# EAGLE design aircitizen-m5stack-v2 (EAGLE 9.4.2)

## Sheet 1 of 2
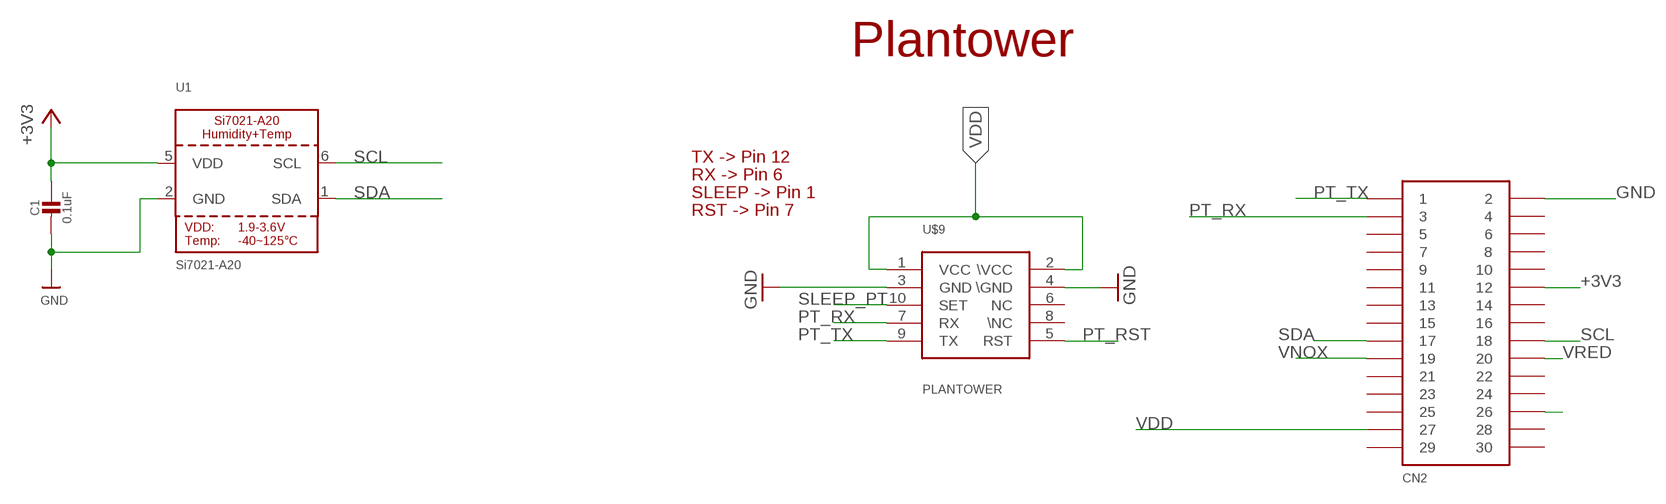
[diagram p0: schematic, sheet 1]

### Parts
C1  0.1uF  CAP_CERAMIC_1206  [_1206]
CN2  CON_PINHD-2X15  [2X15SMD]
U1  Si7021-A20  SI7021-A20  [DFN6_3X3_SI]
U$9  PLANTOWER  [CONN]

### Nets
+3V3: C1.1 CN2.P$12 U1.5(VDD)
GND: C1.2 CN2.P$2 U1.2(GND) U$9.3(GND) U$9.4(\GND) ; also sheet 2
PRE26: CN2.P$26 ; also sheet 2
PT_RST: U$9.5(RST)
PT_RX: CN2.P$3 U$9.7(RX)
PT_TX: CN2.P$1 U$9.9(TX)
SCL: CN2.P$18 U1.6(SCL)
SDA: CN2.P$17 U1.1(SDA)
SLEEP_PT: U$9.10(SET)
VDD: CN2.P$27 U$9.1(VCC) U$9.2(\VCC) ; also sheet 2
VNOX: CN2.P$19 ; also sheet 2
VRED: CN2.P$20 ; also sheet 2
Unconnected: CN2.P$4 CN2.P$5 CN2.P$6 CN2.P$7 CN2.P$8 CN2.P$9 CN2.P$10 CN2.P$11 CN2.P$13 CN2.P$14 CN2.P$15 CN2.P$16 CN2.P$21 CN2.P$22 CN2.P$23 CN2.P$24 CN2.P$25 CN2.P$28 CN2.P$29 CN2.P$30 U$9.6(NC) U$9.8(\NC)

### Notes on the sheet
- Plantower
- TX -> Pin 12
- RX -> Pin 6
- SLEEP -> Pin 1
- RST -> Pin 7

## Sheet 2 of 2
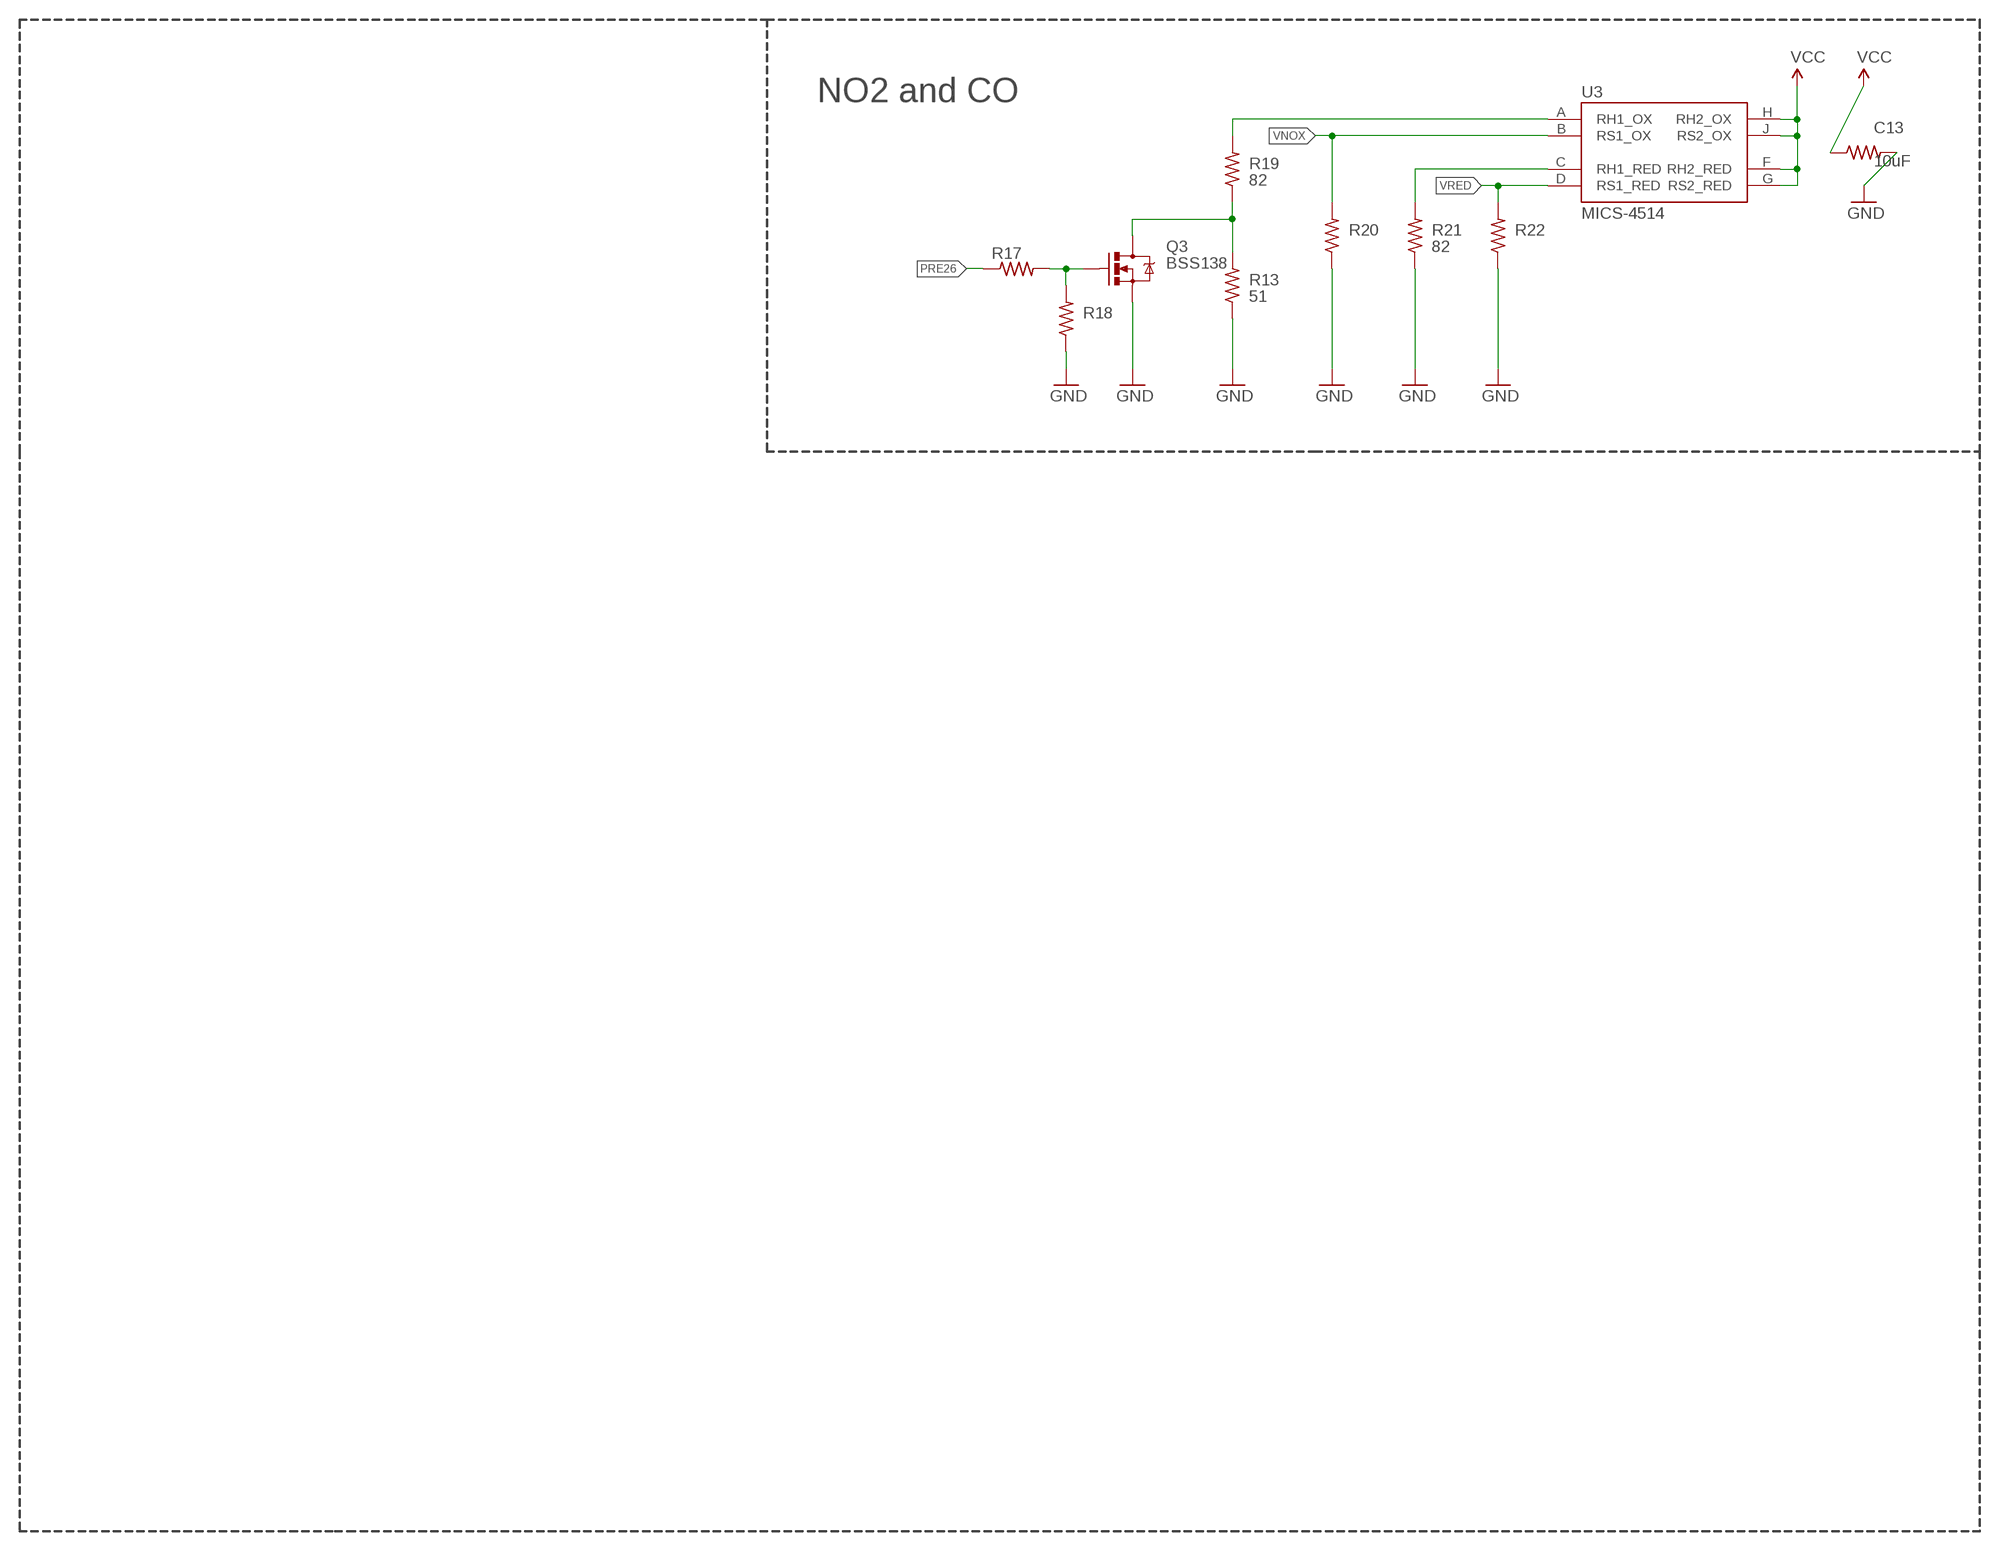
[diagram p1: schematic, sheet 2]

### Parts
C13  10uF  RES-US1206FAB  [R1206FAB]
Q3  MOSFET-NCHANNELBSS138  [SOT23-3]
R13  51  RES-US1206FAB  [R1206FAB]
R17  100  RES-US1206FAB  [R1206FAB]
R18  100K  RES-US1206FAB  [R1206FAB]
R19  82  RES-US1206FAB  [R1206FAB]
R20  22K  RES-US1206FAB  [R1206FAB]
R21  82  RES-US1206FAB  [R1206FAB]
R22  47K  RES-US1206FAB  [R1206FAB]
U3  MICS-4514  [MICS_10-SMD]

### Nets
GND: C13.2 Q3.2(S) R13.1 R18.1 R20.1 R21.1 R22.1 ; also sheet 1
N$7: Q3.3(D) R13.2 R19.1
N$13: Q3.1(G) R17.2 R18.2
N$15: R19.2 U3.A(RH1_OX)
N$16: R21.2 U3.C(RH1_RED)
PRE26: R17.1 ; also sheet 1
VDD: C13.1 U3.F(RH2_RED) U3.G(RS2_RED) U3.H(RH2_OX) U3.J(RS2_OX) ; supply symbol labelled VCC ; also sheet 1
VNOX: R20.2 U3.B(RS1_OX) ; also sheet 1
VRED: R22.2 U3.D(RS1_RED) ; also sheet 1

### Notes on the sheet
- NO2 and CO

## Library data of the parts
C1 = microbuilder:CAP_CERAMIC: Ceramic Capacitors For new designs, use the packages preceded by an '_' character since they are more reliable: The following footprints should be used on most boards: _0402 - Standard footprint for regular board layouts _0603 - Standard footprint for regular board layouts _0805 - Standard footprint for regular board layouts _1206 - Standard footprint for regular board layouts For extremely tight-pitch boards where space is at a premium, the following 'micro-pitch' footprints can be used (smaller pads, no silkscreen outline, etc.): _0402MP - Micro-pitch footprint for very dense/compact boards _0603MP - Micro-pitch footprint for very dense/compact boards _0805MP - Micro-pitch footprint for very dense/compact boards _1206MP - Micro-pitch footprint for very dense/compact boards
C13 = fab:RES-US: Resistor (US Symbol) Variants with postfix FAB are widened to allow the routing of internal traces; PROD_ID: CAP-11330
CN2 = akita:CON_PINHD-2X15
Q3 = SparkFun-DiscreteSemi:MOSFET-NCHANNEL: Common NMOSFET Parts MFG P/N Store ID Prod ID FDD8780 TRANS-09984 SI7820DN TRANS-11055 FDS6630A IC-08089 2N7002PW TRANS-11151 FQP30N06L COM-10213 TRANS-10060 BSS123LT1G TRANS-08345 BSS138 TRANS-00830 BS170 2N7000; PROD_ID: TRANS-00830; P_NAME: BSS138
R13 = fab:RES-US: Resistor (US Symbol) Variants with postfix FAB are widened to allow the routing of internal traces; PROD_ID: RES-12314
R17 R18 R20 R22 = fab:RES-US: Resistor (US Symbol) Variants with postfix FAB are widened to allow the routing of internal traces
R19 R21 = fab:RES-US: Resistor (US Symbol) Variants with postfix FAB are widened to allow the routing of internal traces; DK_ID: 541-82.0CCT-ND
U1 = microbuilder:SI7021-A20: Si7021-A20 - I2C Humidity and Temperature Sensor VDD: 1.9-3.6V Operating Temperature: -40~125°C +/-3% RH (max) 0..80% RH Humidity Sensor +/-0.4°C (max-, -10~85°C Temperature Sensor 150uA Active, 60nA Standby
U3 = SparkFun-Sensors:MICS-4514: Metal oxide MEMS carbon monoxide (CO) and NOx sensor in an SMD package.; PROD_ID: COMP-12310
U$9 = Airbeam:PLANTOWER

## Board
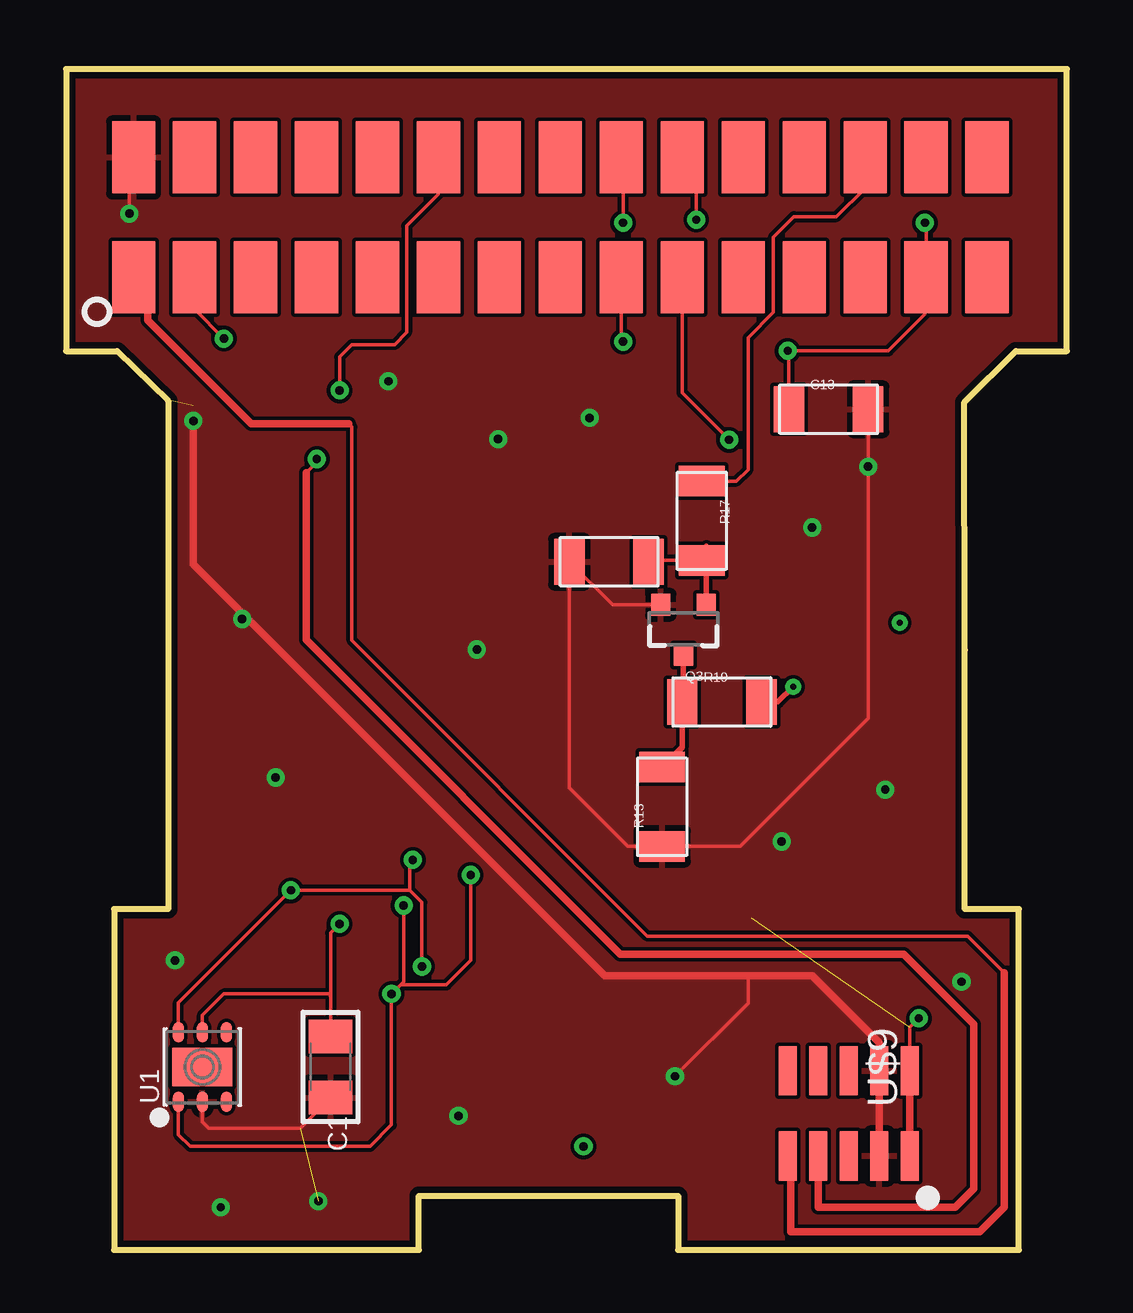
[diagram p2: board, top side]
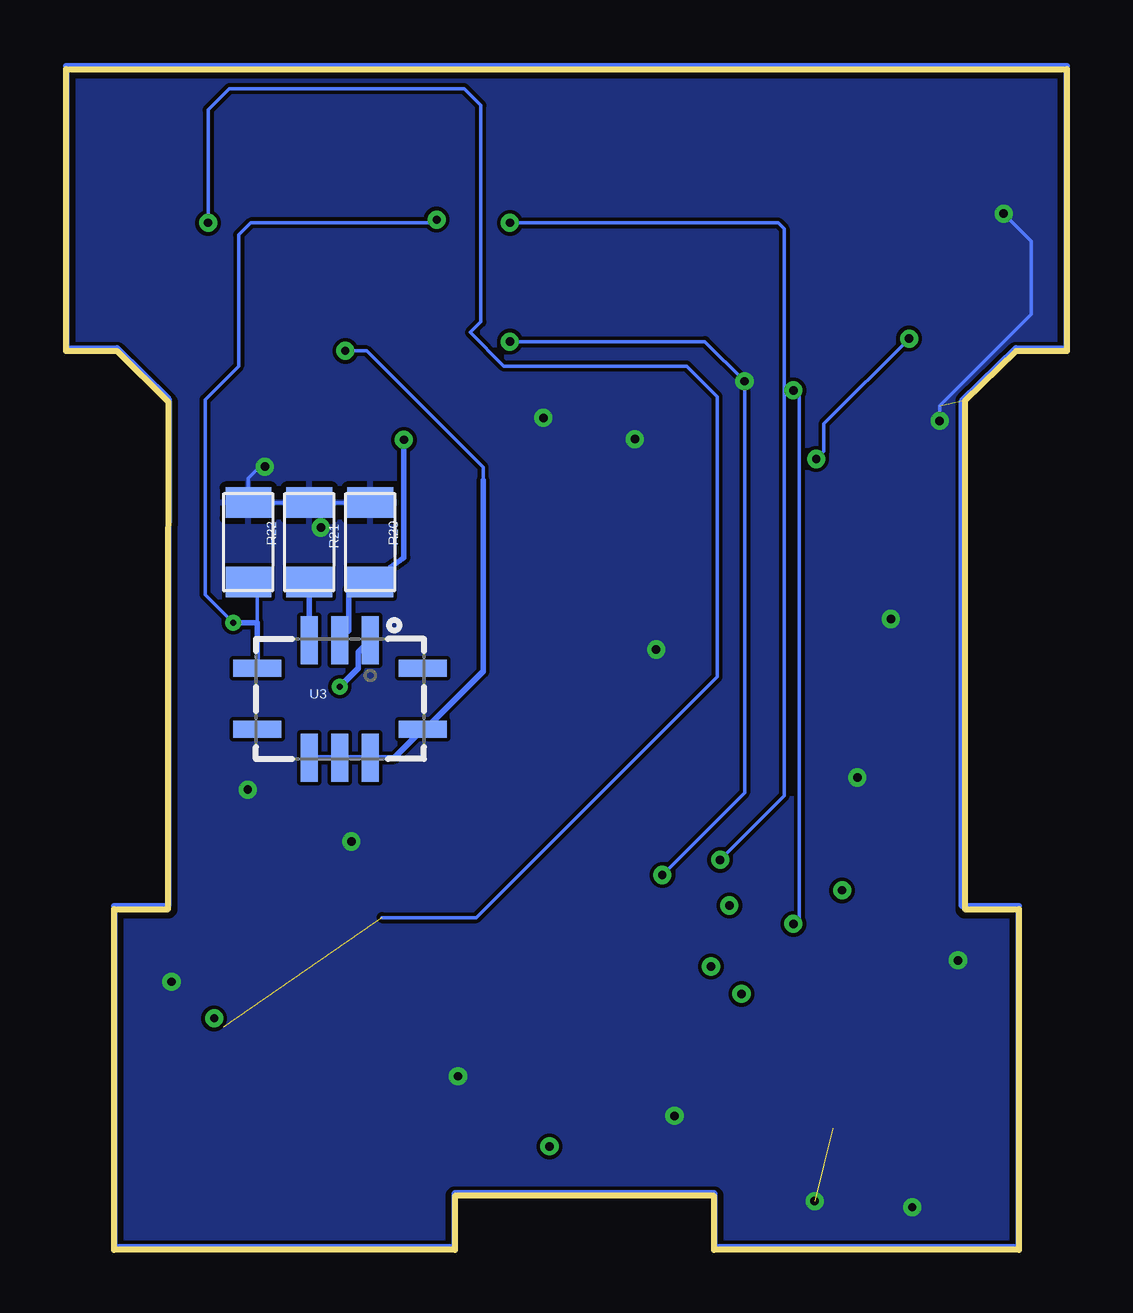
[diagram p3: board, bottom side, seen from below]

Size 41.7 x 49.2 mm. Coordinates in mm from the lower left corner, seen from the top.
Outline: 0,49.2 0,37.45 2.12,37.45 4.25,35.38 4.25,14.2 2,14.2 2,0 14.7,0 14.7,2.25 25.5,2.25 25.5,0 39.7,0 39.7,14.2 37.45,14.2 37.45,24.99 37.43,35.33 39.58,37.45 41.7,37.45 41.7,49.2 0,49.2
Copper layers (1*16): Top 0.035mm / dielectric 1.5mm / Bottom 0.035mm
Design rules "default *": minimum track width 6mil, minimum drill 0.35mm, track to track 6mil, track to pad 6mil, pad to pad 6mil, via to via 6mil, smd to smd 6mil, copper to edge 10mil, drill to drill 6mil, minimum pad ring 10mil, minimum via ring 8mil, stop-mask expansion 4mil, vias tented up to drill 0mil, thermal gap 10mil

### Footprints (pad centres in the part's own frame; a part is rotated, then mirrored left to right if it is on the bottom)
_1206 = smd 1.4 x 1.8: 1 -1.27,0; 2 1.27,0
R1206FAB = smd 1.27 x 1.905: 1 -1.651,0; 2 1.651,0
2X15SMD = smd 3 x 1.8: P$1 -2.5,17.78; P$2 2.5,17.78; P$3 -2.5,15.24; P$4 2.5,15.24; P$5 -2.5,12.7; P$6 2.5,12.7; P$7 -2.5,10.16; P$8 2.5,10.16; P$9 -2.5,7.62; P$10 2.5,7.62; P$11 -2.5,5.08; P$12 2.5,5.08; P$13 -2.5,2.54; P$14 2.5,2.54; P$15 -2.5,0; P$16 2.5,0; P$17 -2.5,-2.54; P$18 2.5,-2.54; P$19 -2.5,-5.08; P$20 2.5,-5.08; P$21 -2.5,-7.62; P$22 2.5,-7.62; P$23 -2.5,-10.16; P$24 2.5,-10.16; P$25 -2.5,-12.7; P$26 2.5,-12.7; P$27 -2.5,-15.24; P$28 2.5,-15.24; P$29 -2.5,-17.78; P$30 2.5,-17.78
SOT23-3 = smd 0.8 x 0.9: 1 -0.95,-1; 2 0.95,-1; 3 0,1.1
DFN6_3X3_SI = smd 0.85 x 0.45: 1 -1.45,1; 2 -1.45,0; 3 -1.45,-1; 4 1.45,-1; 5 1.45,0; 6 1.45,1 | smd 1.6 x 2.5: P$1 0,0
MICS_10-SMD = smd 0.7 x 2: A 1.27,2.45; B 0,2.45; C -1.27,2.45; F -1.27,-2.45; G 0,-2.45; H 1.27,-2.45 | smd 2 x 0.7: D -3.45,1.27; E -3.45,-1.27; J 3.45,-1.27; K 3.45,1.27
CONN = smd 2.05 x 0.76: 1 1.775,2.54; 2 -1.775,2.54; 3 1.775,1.27; 4 -1.775,1.27; 5 1.775,0; 6 -1.775,0; 7 1.775,-1.27; 8 -1.775,-1.27; 9 1.775,-2.54; 10 -1.775,-2.54

### Placement (x,y rotation side)
C1  11.02,7.62 270 top
C13  31.77,35.03 0 top
CN2  20.59,43.03 90 top
Q3  25.72,25.88 180 top
R13  24.83,18.47 90 top
R17  26.49,30.38 270 top
R18  22.62,28.68 0 top
R19  27.32,22.83 0 top
R20  29.03,29.49 270 bottom
R21  31.57,29.49 270 bottom
R22  34.11,29.49 270 bottom
U1  5.68,7.62 90 top
U3  30.3,22.96 0 bottom
U$9  32.61,5.69 270 top

### Tracks (layer width: path | path; a pad name or v marks a point on that pad's centre or on a via)
+3V3  (via drill 0.35)
  Top 0.152: U1.5 5.68,9.78 6.57,10.67 10.99,10.67 11.02,10.53 C1.1 11.02,13.21 v11.4,13.59 | CN2.P$12 15.51,43.99 14.19,42.67 14.19,38.23 13.68,37.72 11.91,37.72 11.4,37.21 v11.4,35.81
  Bottom 0.152: v11.4,35.81 11.14,35.56 11.14,13.84 v11.4,13.59
GND  (via drill 0.35)  (2 unrouted)
  Top 0.152: v25.37,7.24 28.42,10.29 28.42,11.43 | v2.63,43.18 2.63,45.4 2.76,45.53 | Q3.2 22.77,26.88 R18.1 20.97,19.25 23.41,16.82 R13.1 28.09,16.82 33.42,22.15 v33.42,32.64 C13.2 | U1.2 5.68,5.33 5.94,5.08 9.75,5.08 C1.2
  Top 0.305: v5.3,34.54 5.3,28.57 22.45,11.43 28.42,11.43 31.08,11.43 33.88,8.64 U$9.4 U$9.3 | 2.31,45.53 2.76,45.53 CN2.P$2
  Bottom 0.152: 25.5,7.37 v25.37,7.24 | v5.3,34.54 5.3,35.18 1.49,38.99 1.49,42.04 v2.63,43.18 | R20.1 R22.1 34.11,32.16 33.62,32.64 v33.42,32.64
  Bottom 0.254: 2.12,37.58 0,37.58 0,49.33 41.7,49.33 41.7,37.58 39.58,37.58 37.43,35.46 37.45,25.12 37.45,14.33 39.7,14.33 39.7,0.13 25.5,0.13 25.5,2.38 14.7,2.38 14.7,0.13 2,0.13 2,14.33 4.38,14.33 4.38,35.38 2.12,37.58
  other vias: 16.35,5.59 17.11,25.02 18,33.78 13.43,36.2 21.81,34.67 7.33,26.29 8.73,19.68 4.54,12.06 10.51,2.03 6.45,1.78 34.13,19.18 29.81,17.02 31.08,30.1 37.31,11.18
  pour Bottom: 2.12,37.58 0,37.58 0,49.33 41.7,49.33 41.7,37.58 39.58,37.58 37.43,35.46 37.45,25.12 37.45,14.33 39.7,14.33 39.7,0.13 25.5,0.13 25.5,2.38 14.7,2.38 14.7,0.13 2,0.13 2,14.33 4.38,14.33 4.38,35.38
  pour Top: 2.25,37.32 0.13,37.32 0.13,49.07 41.83,49.07 41.83,37.32 39.7,37.32 37.55,35.2 37.58,24.86 37.58,14.07 39.83,14.07 39.83,-0.13 25.63,-0.13 25.63,2.12 14.83,2.12 14.83,-0.13 2.13,-0.13 2.13,14.07 4.38,14.07 4.38,35.25
N$7
  Top 0.229: Q3.3 25.72,22.84 R19.1 25.67,20.95 R13.2
N$13
  Top 0.152: R17.2 24.33,28.73 R18.2
  Top 0.229: Q3.1 26.67,29.32 R17.2
N$15  (via drill 0.25)
  Top 0.229: R19.2 29.66,22.84 v30.3,23.47
  Bottom 0.229: v30.3,23.47 29.53,24.23 29.53,24.9 U3.A
N$16
  Bottom 0.229: R21.2 U3.C
N$25  (via drill 0.35)
  other vias: 21.56,4.32
PRE26
  Top 0.152: R17.1 27.93,32.03 28.42,32.51 28.42,38.01 29.47,39.06 29.47,42.2 30.32,43.05 32.1,43.05 33.29,44.25 CN2.P$26
PT_RX  (via drill 0.35)
  Top 0.152: 10,32.38 10.51,32.89 v10.45,32.96 | v6.57,37.97 5.35,39.19 CN2.P$3
  Top 0.305: 10,32.38 10,25.42 23.1,12.32 34.89,12.32 37.81,9.4 37.81,2.54 37.05,1.78 31.34,1.78 U$9.7
  Bottom 0.152: v10.45,32.96 10.13,33.27 10.13,34.42 v6.57,37.97
PT_TX
  Top 0.152: 39.08,11.56 37.56,13.08 24.23,13.08 11.91,25.4 11.91,34.29 11.78,34.42
  Top 0.305: 39.08,11.56 39.08,1.78 38.07,0.76 30.19,0.76 30.19,3.79 U$9.9 | CN2.P$1 3.4,39.94 3.4,38.73 7.71,34.42 11.78,34.42
SCL  (via drill 0.35)
  Top 0.152: v14.83,11.81 14.83,14.48 14.32,14.99 | 14.32,14.99 v9.37,14.99 4.68,10.3 U1.6 | 14.32,14.99 14.32,16.13 v14.45,16.26 | v23.21,42.8 23.21,45.45 CN2.P$18
  Bottom 0.152: 14.69,11.95 v14.83,11.81 | v23.21,42.8 12.03,42.8 11.78,42.55 11.78,18.92 v14.45,16.26
SDA  (via drill 0.35)
  Top 0.152: v14.06,14.35 14.06,11.18 v13.56,10.67 | v13.56,10.67 13.94,11.05 15.84,11.05 16.86,12.06 v16.86,15.62 | CN2.P$17 23.13,37.77 v23.21,37.85 | U1.1 4.68,4.81 5.17,4.32 12.67,4.32 13.56,5.21 v13.56,10.67
  Bottom 0.152: 14.07,14.09 14.06,14.1 v14.06,14.35 | v16.86,15.62 13.43,19.05 13.43,36.2 15.08,37.85 v23.21,37.85
VDD  (via drill 0.35)  (1 unrouted)
  Top 0.152: v35.53,9.65 35.15,9.27 U$9.2 | v35.78,42.8 35.83,42.75 35.83,40.64 | 35.83,40.64 CN2.P$27 | 35.83,40.64 35.78,40.59 35.78,38.99 34.26,37.47 v30.07,37.47 30.12,37.41 C13.1
  Top 0.305: U$9.2 U$9.1
  Bottom 0.152: 28.54,13.84 24.61,13.84 14.57,23.88 14.57,35.56 15.84,36.83 23.46,36.83 24.86,38.23 24.42,38.67 24.42,47.69 25.11,48.39 34.89,48.39 35.78,47.5 v35.78,42.8 | 24.33,32.07 24.33,32.61 29.18,37.47 v30.07,37.47
  Bottom 0.229: U3.F U3.G U3.H 28.03,20.51 U3.J 26.74,21.69 24.33,24.11 24.33,32.07
VNOX  (via drill 0.35)
  Top 0.152: v27.63,33.76 25.67,35.71 CN2.P$19
  Bottom 0.229: U3.B 29.91,25.79 29.91,27.51 R20.2 27.63,28.85 v27.63,33.76
VRED  (via drill 0.25, 0.35)
  Top 0.152: v26.26,42.93 26.26,44.94 CN2.P$20
  Bottom 0.152: 33.75,26.04 33.75,27.48 R22.2 | v34.74,26.14 35.91,27.3 35.91,35.43 34.51,36.83 34.51,42.29 34,42.8 26.38,42.8 v26.26,42.93
  Bottom 0.229: U3.D 33.75,26.04 33.75,26.14 v34.74,26.14